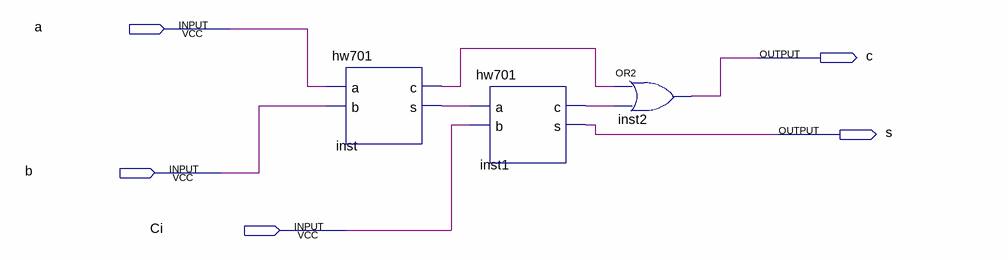
[diagram p0: schematic sheet]
// Quartus schematic hw702.bdf as structural Verilog: 3 symbols, 5 pins
module hw702 (
  input  a,
  input  b,
  input  Ci,
  output c,
  output s
);

  wire inst1_c, inst_c, inst_s;

  hw701 inst (.a(a), .b(b), .c(inst_c), .s(inst_s));
  hw701 inst1 (.a(inst_s), .b(Ci), .c(inst1_c), .s(s));
  or inst2 (c, inst_c, inst1_c);
endmodule
